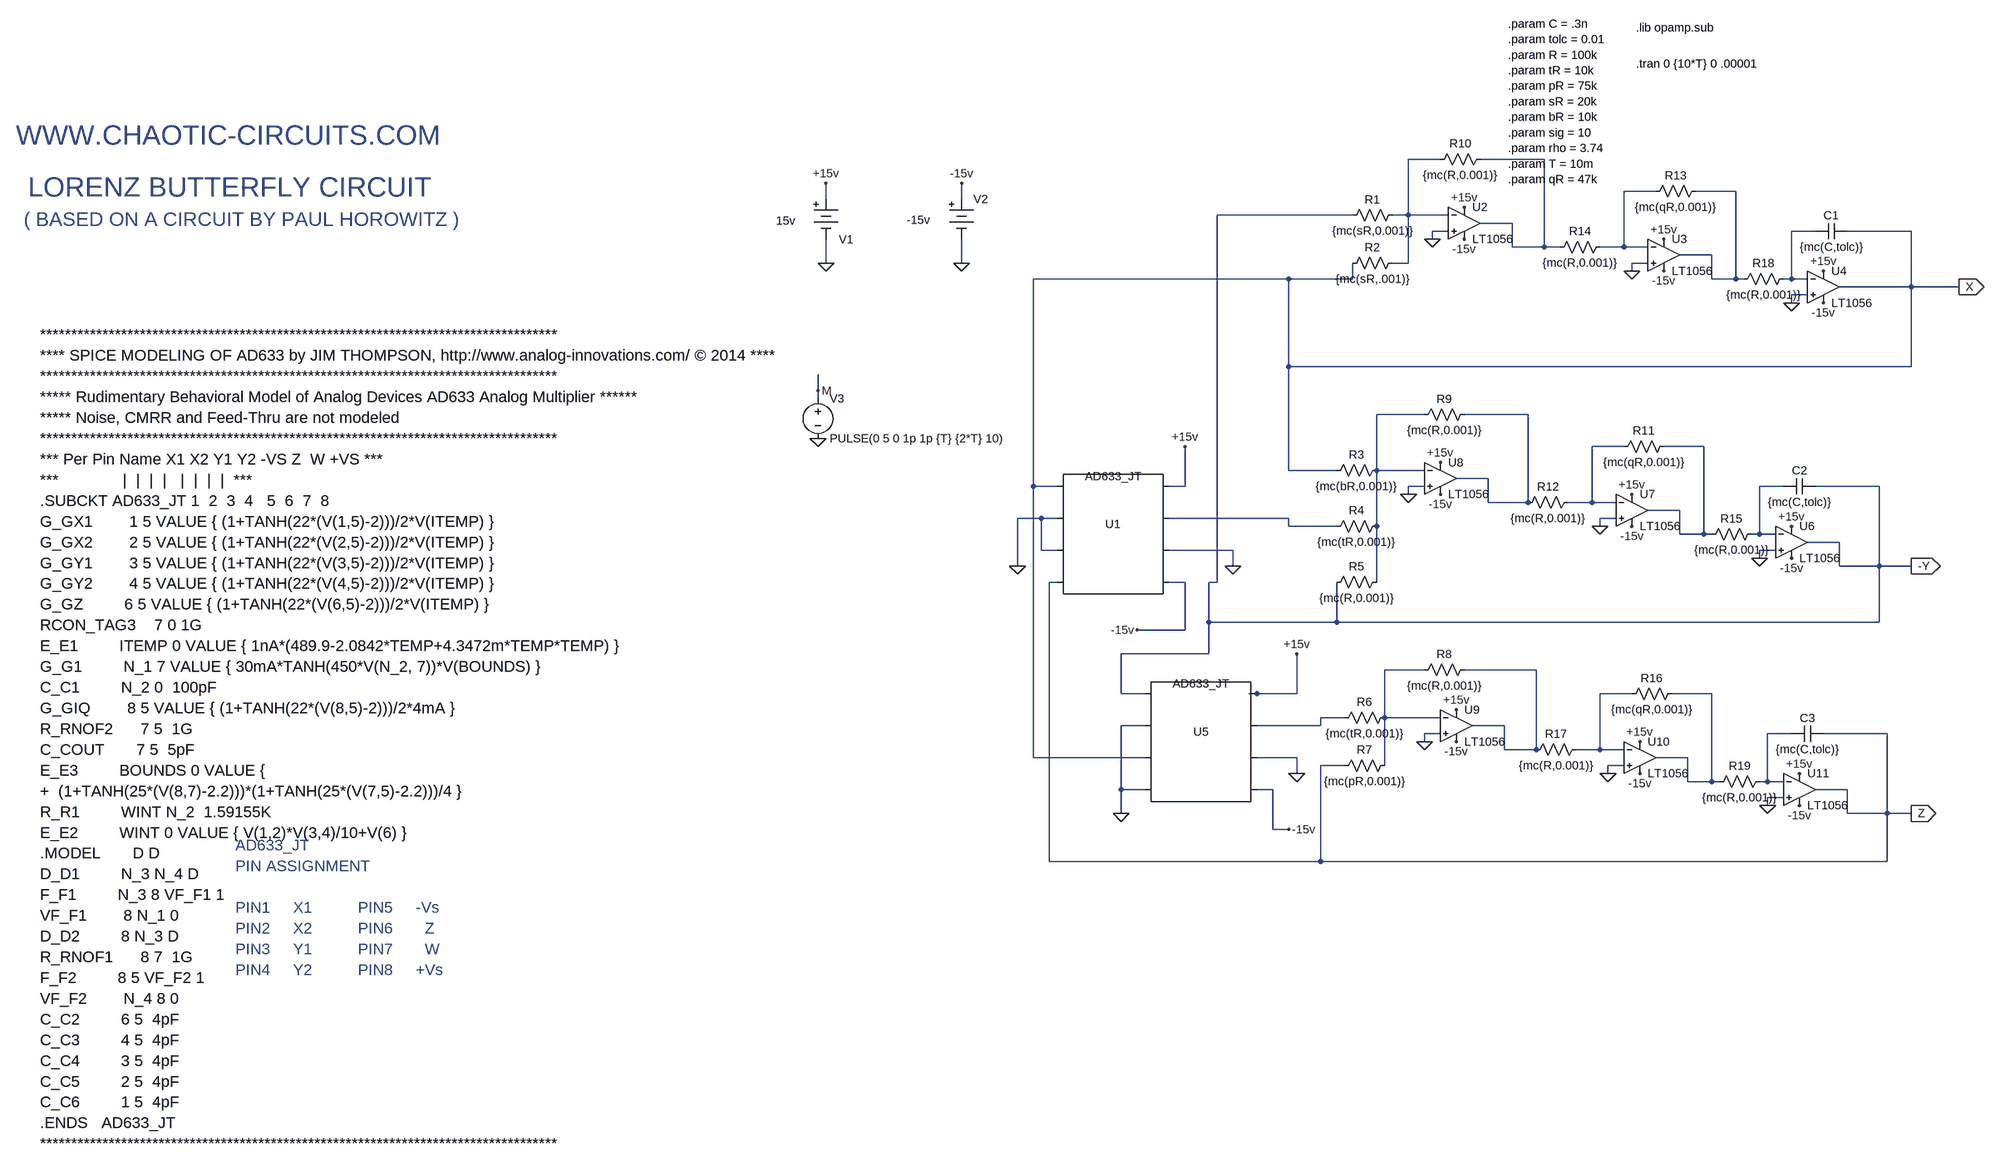
[diagram p0: schematic CSK_LT1056.asc]
CSK_LT1056.asc, the LTspice schematic file:
Version 4
SHEET 1 880 2376
WIRE -3440 544 -3504 544
WIRE -3232 544 -3360 544
WIRE -3008 608 -3072 608
WIRE -2848 608 -2928 608
WIRE -4672 624 -4672 592
WIRE -4400 624 -4400 592
WIRE -3616 656 -3888 656
WIRE -3504 656 -3504 544
WIRE -3504 656 -3536 656
WIRE -3424 656 -3504 656
WIRE -3296 672 -3360 672
WIRE -3424 688 -3456 688
WIRE -2688 688 -2736 688
WIRE -2496 688 -2624 688
WIRE -3456 704 -3456 688
WIRE -3296 720 -3296 672
WIRE -3232 720 -3232 544
WIRE -3232 720 -3296 720
WIRE -3200 720 -3232 720
WIRE -3072 720 -3072 608
WIRE -3072 720 -3120 720
WIRE -3024 720 -3072 720
WIRE -2896 736 -2960 736
WIRE -4672 752 -4672 704
WIRE -4400 752 -4400 704
WIRE -3504 752 -3504 656
WIRE -3504 752 -3536 752
WIRE -3024 752 -3056 752
WIRE -3056 768 -3056 752
WIRE -3744 784 -4256 784
WIRE -3616 784 -3616 752
WIRE -3616 784 -3744 784
WIRE -2896 784 -2896 736
WIRE -2848 784 -2848 608
WIRE -2848 784 -2896 784
WIRE -2832 784 -2848 784
WIRE -2736 784 -2736 688
WIRE -2736 784 -2752 784
WIRE -2704 784 -2736 784
WIRE -2496 800 -2496 688
WIRE -2496 800 -2640 800
WIRE -2400 800 -2496 800
WIRE -2704 816 -2736 816
WIRE -2736 832 -2736 816
WIRE -3744 960 -3744 784
WIRE -2496 960 -2496 800
WIRE -2496 960 -3744 960
WIRE -4688 1008 -4688 976
WIRE -4688 1024 -4688 1008
WIRE -3472 1056 -3568 1056
WIRE -3264 1056 -3392 1056
WIRE -3072 1120 -3136 1120
WIRE -2912 1120 -2992 1120
WIRE -3744 1168 -3744 960
WIRE -3648 1168 -3744 1168
WIRE -3568 1168 -3568 1056
WIRE -3472 1168 -3568 1168
WIRE -3344 1184 -3408 1184
WIRE -4256 1200 -4256 784
WIRE -4208 1200 -4256 1200
WIRE -3952 1200 -3952 1120
WIRE -3952 1200 -3984 1200
WIRE -3472 1200 -3504 1200
WIRE -2752 1200 -2800 1200
WIRE -2560 1200 -2688 1200
WIRE -3504 1216 -3504 1200
WIRE -3344 1232 -3344 1184
WIRE -3264 1232 -3264 1056
WIRE -3264 1232 -3344 1232
WIRE -3136 1232 -3136 1120
WIRE -3136 1232 -3184 1232
WIRE -3088 1232 -3136 1232
WIRE -2960 1248 -3024 1248
WIRE -4240 1264 -4288 1264
WIRE -4208 1264 -4240 1264
WIRE -3744 1264 -3984 1264
WIRE -3088 1264 -3120 1264
WIRE -3744 1280 -3744 1264
WIRE -3648 1280 -3744 1280
WIRE -3568 1280 -3568 1168
WIRE -3120 1280 -3120 1264
WIRE -2960 1296 -2960 1248
WIRE -2912 1296 -2912 1120
WIRE -2912 1296 -2960 1296
WIRE -2896 1296 -2912 1296
WIRE -2800 1296 -2800 1200
WIRE -2800 1296 -2816 1296
WIRE -2768 1296 -2800 1296
WIRE -2640 1312 -2704 1312
WIRE -4240 1328 -4240 1264
WIRE -4208 1328 -4240 1328
WIRE -3856 1328 -3984 1328
WIRE -2768 1328 -2800 1328
WIRE -2800 1344 -2800 1328
WIRE -4288 1360 -4288 1264
WIRE -3856 1360 -3856 1328
WIRE -2640 1360 -2640 1312
WIRE -2560 1360 -2560 1200
WIRE -2560 1360 -2640 1360
WIRE -2496 1360 -2560 1360
WIRE -4208 1392 -4224 1392
WIRE -3952 1392 -3984 1392
WIRE -3888 1392 -3888 656
WIRE -3888 1392 -3904 1392
WIRE -3568 1392 -3568 1280
WIRE -3904 1472 -3904 1392
WIRE -3648 1472 -3648 1392
WIRE -3648 1472 -3904 1472
WIRE -2560 1472 -2560 1360
WIRE -2560 1472 -3648 1472
WIRE -3952 1488 -3952 1392
WIRE -3952 1488 -4048 1488
WIRE -3904 1536 -3904 1472
WIRE -3904 1536 -4080 1536
WIRE -3472 1568 -3552 1568
WIRE -3248 1568 -3392 1568
WIRE -4080 1616 -4080 1536
WIRE -4032 1616 -4080 1616
WIRE -3808 1616 -3824 1616
WIRE -3728 1616 -3728 1536
WIRE -3728 1616 -3808 1616
WIRE -3056 1616 -3120 1616
WIRE -2896 1616 -2976 1616
WIRE -3632 1664 -3680 1664
WIRE -3552 1664 -3552 1568
WIRE -3440 1664 -3552 1664
WIRE -4032 1680 -4080 1680
WIRE -3680 1680 -3680 1664
WIRE -3680 1680 -3808 1680
WIRE -3312 1680 -3376 1680
WIRE -3440 1696 -3472 1696
WIRE -2736 1696 -2784 1696
WIRE -2544 1696 -2672 1696
WIRE -3472 1712 -3472 1696
WIRE -3312 1728 -3312 1680
WIRE -3248 1728 -3248 1568
WIRE -3248 1728 -3312 1728
WIRE -3120 1728 -3120 1616
WIRE -3120 1728 -3168 1728
WIRE -3072 1728 -3120 1728
WIRE -4256 1744 -4256 1200
WIRE -4032 1744 -4256 1744
WIRE -3728 1744 -3808 1744
WIRE -2944 1744 -3008 1744
WIRE -3632 1760 -3680 1760
WIRE -3552 1760 -3552 1664
WIRE -3072 1760 -3104 1760
WIRE -3728 1776 -3728 1744
WIRE -3104 1776 -3104 1760
WIRE -2944 1792 -2944 1744
WIRE -2896 1792 -2896 1616
WIRE -2896 1792 -2944 1792
WIRE -2880 1792 -2896 1792
WIRE -2784 1792 -2784 1696
WIRE -2784 1792 -2800 1792
WIRE -2752 1792 -2784 1792
WIRE -4080 1808 -4080 1680
WIRE -4032 1808 -4080 1808
WIRE -3776 1808 -3808 1808
WIRE -2624 1808 -2688 1808
WIRE -2752 1824 -2784 1824
WIRE -2784 1840 -2784 1824
WIRE -4080 1856 -4080 1808
WIRE -2624 1856 -2624 1808
WIRE -2544 1856 -2544 1696
WIRE -2544 1856 -2624 1856
WIRE -2496 1856 -2544 1856
WIRE -3776 1888 -3776 1808
WIRE -3744 1888 -3776 1888
WIRE -4224 1952 -4224 1392
WIRE -3680 1952 -3680 1760
WIRE -3680 1952 -4224 1952
WIRE -2544 1952 -2544 1856
WIRE -2544 1952 -3680 1952
FLAG -2496 1856 Z
IOPIN -2496 1856 Out
FLAG -3456 704 0
FLAG -4672 752 0
FLAG -4400 752 0
FLAG -2496 1360 -Y
IOPIN -2496 1360 Out
FLAG -4672 592 +15v
FLAG -4400 592 -15v
FLAG -3952 1120 +15v
FLAG -3728 1536 +15v
FLAG -3744 1888 -15v
FLAG -4048 1488 -15v
FLAG -3728 1776 0
FLAG -3856 1360 0
FLAG -4288 1360 0
FLAG -4080 1856 0
FLAG -4688 1104 0
FLAG -4688 1008 M
FLAG -2400 800 X
IOPIN -2400 800 Out
FLAG -3392 640 +15v
FLAG -3392 704 -15v
FLAG -3504 1216 0
FLAG -3440 1152 +15v
FLAG -3440 1216 -15v
FLAG -3472 1712 0
FLAG -3408 1648 +15v
FLAG -3408 1712 -15v
FLAG -3056 768 0
FLAG -2992 704 +15v
FLAG -2992 768 -15v
FLAG -2736 832 0
FLAG -2672 768 +15v
FLAG -2672 832 -15v
FLAG -3120 1280 0
FLAG -3056 1216 +15v
FLAG -3056 1280 -15v
FLAG -2800 1344 0
FLAG -2736 1280 +15v
FLAG -2736 1344 -15v
FLAG -3104 1776 0
FLAG -3040 1712 +15v
FLAG -3040 1776 -15v
FLAG -2784 1840 0
FLAG -2720 1776 +15v
FLAG -2720 1840 -15v
SYMBOL res -3632 672 R270
WINDOW 0 32 56 VTop 2
WINDOW 3 0 56 VBottom 2
SYMATTR InstName R1
SYMATTR Value {mc(sR,0.001)}
SYMATTR SpiceLine tol=1
SYMBOL res -3664 1184 R270
WINDOW 0 32 56 VTop 2
WINDOW 3 0 56 VBottom 2
SYMATTR InstName R3
SYMATTR Value {mc(bR,0.001)}
SYMATTR SpiceLine tol=1
SYMBOL res -3664 1296 R270
WINDOW 0 32 56 VTop 2
WINDOW 3 0 56 VBottom 2
SYMATTR InstName R4
SYMATTR Value {mc(tR,0.001)}
SYMATTR SpiceLine tol=1
SYMBOL res -3664 1408 R270
WINDOW 0 32 56 VTop 2
WINDOW 3 0 56 VBottom 2
SYMATTR InstName R5
SYMATTR Value {mc(R,0.001)}
SYMATTR SpiceLine tol=1
SYMBOL res -3632 768 R270
WINDOW 0 32 56 VTop 2
WINDOW 3 0 56 VBottom 2
SYMATTR InstName R2
SYMATTR Value {mc(sR,.001)}
SYMATTR SpiceLine tol=1
SYMBOL cap -2688 704 R270
WINDOW 0 32 32 VTop 2
WINDOW 3 0 32 VBottom 2
SYMATTR InstName C1
SYMATTR Value {mc(C,tolc)}
SYMBOL res -3648 1680 R270
WINDOW 0 32 56 VTop 2
WINDOW 3 0 56 VBottom 2
SYMATTR InstName R6
SYMATTR Value {mc(tR,0.001)}
SYMATTR SpiceLine tol=1
SYMBOL res -3648 1776 R270
WINDOW 0 32 56 VTop 2
WINDOW 3 0 56 VBottom 2
SYMATTR InstName R7
SYMATTR Value {mc(pR,0.001)}
SYMATTR SpiceLine tol=1
SYMBOL battery -4672 608 R0
WINDOW 0 26 97 Left 2
WINDOW 3 -100 59 Left 2
WINDOW 123 0 0 Left 2
WINDOW 39 0 0 Left 2
SYMATTR InstName V1
SYMATTR Value 15v
SYMBOL battery -4400 608 R0
WINDOW 3 -110 58 Left 2
WINDOW 123 0 0 Left 2
WINDOW 39 0 0 Left 2
SYMATTR Value -15v
SYMATTR InstName V2
SYMBOL DIP8 -4096 1296 R0
WINDOW 3 0 -116 Center 2
SYMATTR Value AD633_JT
SYMATTR InstName U1
SYMBOL DIP8 -3920 1712 R0
WINDOW 3 0 -116 Center 2
SYMATTR Value AD633_JT
SYMATTR InstName U5
SYMBOL voltage -4688 1008 R0
WINDOW 123 0 0 Left 2
WINDOW 39 0 0 Left 2
SYMATTR InstName V3
SYMATTR Value PULSE(0 5 0 1p 1p {T} {2*T} 10)
SYMBOL res -3376 1552 R90
WINDOW 0 0 56 VBottom 2
WINDOW 3 32 56 VTop 2
SYMATTR InstName R8
SYMATTR Value {mc(R,0.001)}
SYMBOL res -3376 1040 R90
WINDOW 0 0 56 VBottom 2
WINDOW 3 32 56 VTop 2
SYMATTR InstName R9
SYMATTR Value {mc(R,0.001)}
SYMBOL res -3344 528 R90
WINDOW 0 0 56 VBottom 2
WINDOW 3 32 56 VTop 2
SYMATTR InstName R10
SYMATTR Value {mc(R,0.001)}
SYMBOL res -2912 592 R90
WINDOW 0 0 56 VBottom 2
WINDOW 3 32 56 VTop 2
SYMATTR InstName R13
SYMATTR Value {mc(qR,0.001)}
SYMBOL res -3104 704 R90
WINDOW 0 0 56 VBottom 2
WINDOW 3 32 56 VTop 2
SYMATTR InstName R14
SYMATTR Value {mc(R,0.001)}
SYMBOL res -2736 768 R90
WINDOW 0 0 56 VBottom 2
WINDOW 3 32 56 VTop 2
SYMATTR InstName R18
SYMATTR Value {mc(R,0.001)}
SYMBOL cap -2752 1216 R270
WINDOW 0 32 32 VTop 2
WINDOW 3 0 32 VBottom 2
SYMATTR InstName C2
SYMATTR Value {mc(C,tolc)}
SYMBOL res -2976 1104 R90
WINDOW 0 0 56 VBottom 2
WINDOW 3 32 56 VTop 2
SYMATTR InstName R11
SYMATTR Value {mc(qR,0.001)}
SYMBOL res -3168 1216 R90
WINDOW 0 0 56 VBottom 2
WINDOW 3 32 56 VTop 2
SYMATTR InstName R12
SYMATTR Value {mc(R,0.001)}
SYMBOL res -2800 1280 R90
WINDOW 0 0 56 VBottom 2
WINDOW 3 32 56 VTop 2
SYMATTR InstName R15
SYMATTR Value {mc(R,0.001)}
SYMBOL cap -2736 1712 R270
WINDOW 0 32 32 VTop 2
WINDOW 3 0 32 VBottom 2
SYMATTR InstName C3
SYMATTR Value {mc(C,tolc)}
SYMBOL res -2960 1600 R90
WINDOW 0 0 56 VBottom 2
WINDOW 3 32 56 VTop 2
SYMATTR InstName R16
SYMATTR Value {mc(qR,0.001)}
SYMBOL res -3152 1712 R90
WINDOW 0 0 56 VBottom 2
WINDOW 3 32 56 VTop 2
SYMATTR InstName R17
SYMATTR Value {mc(R,0.001)}
SYMBOL res -2784 1776 R90
WINDOW 0 0 56 VBottom 2
WINDOW 3 32 56 VTop 2
SYMATTR InstName R19
SYMATTR Value {mc(R,0.001)}
SYMBOL Opamps/LT1056 -3392 608 R0
SYMATTR InstName U2
SYMBOL Opamps/LT1056 -2992 672 R0
SYMATTR InstName U3
SYMBOL Opamps/LT1056 -2672 736 R0
SYMATTR InstName U4
SYMBOL Opamps/LT1056 -2736 1248 R0
SYMATTR InstName U6
SYMBOL Opamps/LT1056 -3056 1184 R0
SYMATTR InstName U7
SYMBOL Opamps/LT1056 -3440 1120 R0
SYMATTR InstName U8
SYMBOL Opamps/LT1056 -3408 1616 R0
SYMATTR InstName U9
SYMBOL Opamps/LT1056 -3040 1680 R0
SYMATTR InstName U10
SYMBOL Opamps/LT1056 -2720 1744 R0
SYMATTR InstName U11
TEXT -3048 352 Left 2 !.tran 0 {10*T} 0 .00001
TEXT -6280 664 Left 4 ;( BASED ON A CIRCUIT BY PAUL HOROWITZ )
TEXT -6272 600 Left 5 ;LORENZ BUTTERFLY CIRCUIT
TEXT -6296 496 Left 5 ;WWW.CHAOTIC-CIRCUITS.COM
TEXT -6248 896 Left 3 !***********************************************************************************\n**** SPICE MODELING OF AD633 by JIM THOMPSON, http://www.analog-innovations.com/ © 2014 ****\n***********************************************************************************\n***** Rudimentary Behavioral Model of Analog Devices AD633 Analog Multiplier ******\n***** Noise, CMRR and Feed-Thru are not modeled\n***********************************************************************************\n*** Per Pin Name X1 X2 Y1 Y2 -VS Z  W +VS ***\n***              |  |  |  |   |  |  |  |  ***\n.SUBCKT AD633_JT 1  2  3  4   5  6  7  8 \nG_GX1        1 5 VALUE { (1+TANH(22*(V(1,5)-2)))/2*V(ITEMP) }\nG_GX2        2 5 VALUE { (1+TANH(22*(V(2,5)-2)))/2*V(ITEMP) }\nG_GY1        3 5 VALUE { (1+TANH(22*(V(3,5)-2)))/2*V(ITEMP) }\nG_GY2        4 5 VALUE { (1+TANH(22*(V(4,5)-2)))/2*V(ITEMP) }\nG_GZ         6 5 VALUE { (1+TANH(22*(V(6,5)-2)))/2*V(ITEMP) }\nRCON_TAG3    7 0 1G\nE_E1         ITEMP 0 VALUE { 1nA*(489.9-2.0842*TEMP+4.3472m*TEMP*TEMP) }\nG_G1         N_1 7 VALUE { 30mA*TANH(450*V(N_2, 7))*V(BOUNDS) }\nC_C1         N_2 0  100pF \nG_GIQ        8 5 VALUE { (1+TANH(22*(V(8,5)-2)))/2*4mA }\nR_RNOF2      7 5  1G \nC_COUT       7 5  5pF \nE_E3         BOUNDS 0 VALUE {\n+  (1+TANH(25*(V(8,7)-2.2)))*(1+TANH(25*(V(7,5)-2.2)))/4 }\nR_R1         WINT N_2  1.59155K \nE_E2         WINT 0 VALUE { V(1,2)*V(3,4)/10+V(6) }\n.MODEL       D D\nD_D1         N_3 N_4 D \nF_F1         N_3 8 VF_F1 1\nVF_F1        8 N_1 0\nD_D2         8 N_3 D \nR_RNOF1      8 7  1G \nF_F2         8 5 VF_F2 1\nVF_F2        N_4 8 0\nC_C2         6 5  4pF \nC_C3         4 5  4pF \nC_C4         3 5  4pF \nC_C5         2 5  4pF \nC_C6         1 5  4pF \n.ENDS   AD633_JT\n***********************************************************************************
TEXT -5856 1920 Left 3 ;AD633_JT\nPIN ASSIGNMENT\n \nPIN1     X1          PIN5     -Vs\nPIN2     X2          PIN6       Z\nPIN3     Y1          PIN7       W\nPIN4     Y2          PIN8     +Vs
TEXT -3048 280 Left 2 !.lib opamp.sub
TEXT -3304 272 Left 2 !.param C = .3n\n.param tolc = 0.01\n.param R = 100k\n.param tR = 10k\n.param pR = 75k\n.param sR = 20k\n.param bR = 10k\n.param sig = 10\n.param rho = 3.74\n.param T = 10m\n.param qR = 47k

The netlist it stands for:
* CSK_LT1056.asc
R1 -Y N001 {mc(sR,0.001)} tol=1
R3 X N006 {mc(bR,0.001)} tol=1
R4 N011 N006 {mc(tR,0.001)} tol=1
R5 -Y N006 {mc(R,0.001)} tol=1
R2 X N001 {mc(sR,.001)} tol=1
C1 N005 X {mc(C,tolc)}
R6 N016 N012 {mc(tR,0.001)} tol=1
R7 Z N012 {mc(pR,0.001)} tol=1
V1 +15v 0 15v
V2 -15v 0 -15v
XU1 X 0 0 Z -15v 0 N011 +15v AD633_JT
XU5 -Y 0 X 0 -15v 0 N016 +15v AD633_JT
V3 M 0 PULSE(0 5 0 1p 1p {T} {2*T} 10)
R8 N013 N012 {mc(R,0.001)}
R9 N007 N006 {mc(R,0.001)}
R10 N002 N001 {mc(R,0.001)}
R13 N004 N003 {mc(qR,0.001)}
R14 N003 N002 {mc(R,0.001)}
R18 N005 N004 {mc(R,0.001)}
C2 N010 -Y {mc(C,tolc)}
R11 N009 N008 {mc(qR,0.001)}
R12 N008 N007 {mc(R,0.001)}
R15 N010 N009 {mc(R,0.001)}
C3 N017 Z {mc(C,tolc)}
R16 N015 N014 {mc(qR,0.001)}
R17 N014 N013 {mc(R,0.001)}
R19 N017 N015 {mc(R,0.001)}
XU2 0 N001 +15v -15v N002 LT1056  ; pins In+ In- V+ V- OUT
XU3 0 N003 +15v -15v N004 LT1056  ; pins In+ In- V+ V- OUT
XU4 0 N005 +15v -15v X LT1056  ; pins In+ In- V+ V- OUT
XU6 0 N010 +15v -15v -Y LT1056  ; pins In+ In- V+ V- OUT
XU7 0 N008 +15v -15v N009 LT1056  ; pins In+ In- V+ V- OUT
XU8 0 N006 +15v -15v N007 LT1056  ; pins In+ In- V+ V- OUT
XU9 0 N012 +15v -15v N013 LT1056  ; pins In+ In- V+ V- OUT
XU10 0 N014 +15v -15v N015 LT1056  ; pins In+ In- V+ V- OUT
XU11 0 N017 +15v -15v Z LT1056  ; pins In+ In- V+ V- OUT
.tran 0 {10*T} 0 .00001
* ( BASED ON A CIRCUIT BY PAUL HOROWITZ )
* LORENZ BUTTERFLY CIRCUIT
* WWW.CHAOTIC-CIRCUITS.COM
***********************************************************************************
**** SPICE MODELING OF AD633 by JIM THOMPSON, http://www.analog-innovations.com/ © 2014 ****
***********************************************************************************
***** Rudimentary Behavioral Model of Analog Devices AD633 Analog Multiplier ******
***** Noise, CMRR and Feed-Thru are not modeled
***********************************************************************************
*** Per Pin Name X1 X2 Y1 Y2 -VS Z  W +VS ***
***              |  |  |  |   |  |  |  |  ***
.SUBCKT AD633_JT 1  2  3  4   5  6  7  8
G_GX1        1 5 VALUE { (1+TANH(22*(V(1,5)-2)))/2*V(ITEMP) }
G_GX2        2 5 VALUE { (1+TANH(22*(V(2,5)-2)))/2*V(ITEMP) }
G_GY1        3 5 VALUE { (1+TANH(22*(V(3,5)-2)))/2*V(ITEMP) }
G_GY2        4 5 VALUE { (1+TANH(22*(V(4,5)-2)))/2*V(ITEMP) }
G_GZ         6 5 VALUE { (1+TANH(22*(V(6,5)-2)))/2*V(ITEMP) }
RCON_TAG3    7 0 1G
E_E1         ITEMP 0 VALUE { 1nA*(489.9-2.0842*TEMP+4.3472m*TEMP*TEMP) }
G_G1         N_1 7 VALUE { 30mA*TANH(450*V(N_2, 7))*V(BOUNDS) }
C_C1         N_2 0  100pF
G_GIQ        8 5 VALUE { (1+TANH(22*(V(8,5)-2)))/2*4mA }
R_RNOF2      7 5  1G
C_COUT       7 5  5pF
E_E3         BOUNDS 0 VALUE {
+  (1+TANH(25*(V(8,7)-2.2)))*(1+TANH(25*(V(7,5)-2.2)))/4 }
R_R1         WINT N_2  1.59155K
E_E2         WINT 0 VALUE { V(1,2)*V(3,4)/10+V(6) }
.MODEL       D D
D_D1         N_3 N_4 D
F_F1         N_3 8 VF_F1 1
VF_F1        8 N_1 0
D_D2         8 N_3 D
R_RNOF1      8 7  1G
F_F2         8 5 VF_F2 1
VF_F2        N_4 8 0
C_C2         6 5  4pF
C_C3         4 5  4pF
C_C4         3 5  4pF
C_C5         2 5  4pF
C_C6         1 5  4pF
.ENDS   AD633_JT
***********************************************************************************
* AD633_JT
* PIN ASSIGNMENT
* PIN1     X1          PIN5     -Vs
* PIN2     X2          PIN6       Z
* PIN3     Y1          PIN7       W
* PIN4     Y2          PIN8     +Vs
.lib opamp.sub
.param C = .3n
.param tolc = 0.01
.param R = 100k
.param tR = 10k
.param pR = 75k
.param sR = 20k
.param bR = 10k
.param sig = 10
.param rho = 3.74
.param T = 10m
.param qR = 47k
.backanno
.end